# Altium schematic sheet TIDA-010967_DC_Regulators.SchDoc: DC_REGULATORS
size 431 x 279 mm; Date: Not shown in title block; ApprovedBy: Not shown in title block; CheckedBy: Not shown in title block; Author: Not shown in title block; CompanyName: Not shown in title block; DrawnBy: Justin Yin; Engineer: Not shown in title block; Organization: Not shown in title block; Address1: Not shown in title block; Address2: Not shown in title block; Address3: Not shown in title block; Address4: Not shown in title block; DocumentNumber: 4; Revision: Use project parameter SCH_Rev; SheetNumber: 4; SheetTotal: 8; PageSetup: Record=PageOptions|CenterHorizontal=True|CenterVertical=True|PrintScale=1.00|XCorrection=1.00|YCorrection=1.00|PrintKind=0|BorderSize=5000000|LeftOffset=0|BottomOffset=0|Orientation=2|PaperLength=1000|PaperWidth=1000|Scale=100|PaperSource=15|PrintQuality=600|MediaType=1|DitherType=10|PaperKind=Letter|PrintScaleMode=1; CurrentTime: Not shown in title block; CurrentDate: Not shown in title block; Time: Not shown in title block; DocumentFullPathAndName: Not shown in title block; DocumentName: Not shown in title block; ModifiedDate: Not shown in title block; ImagePath: Not shown in title block
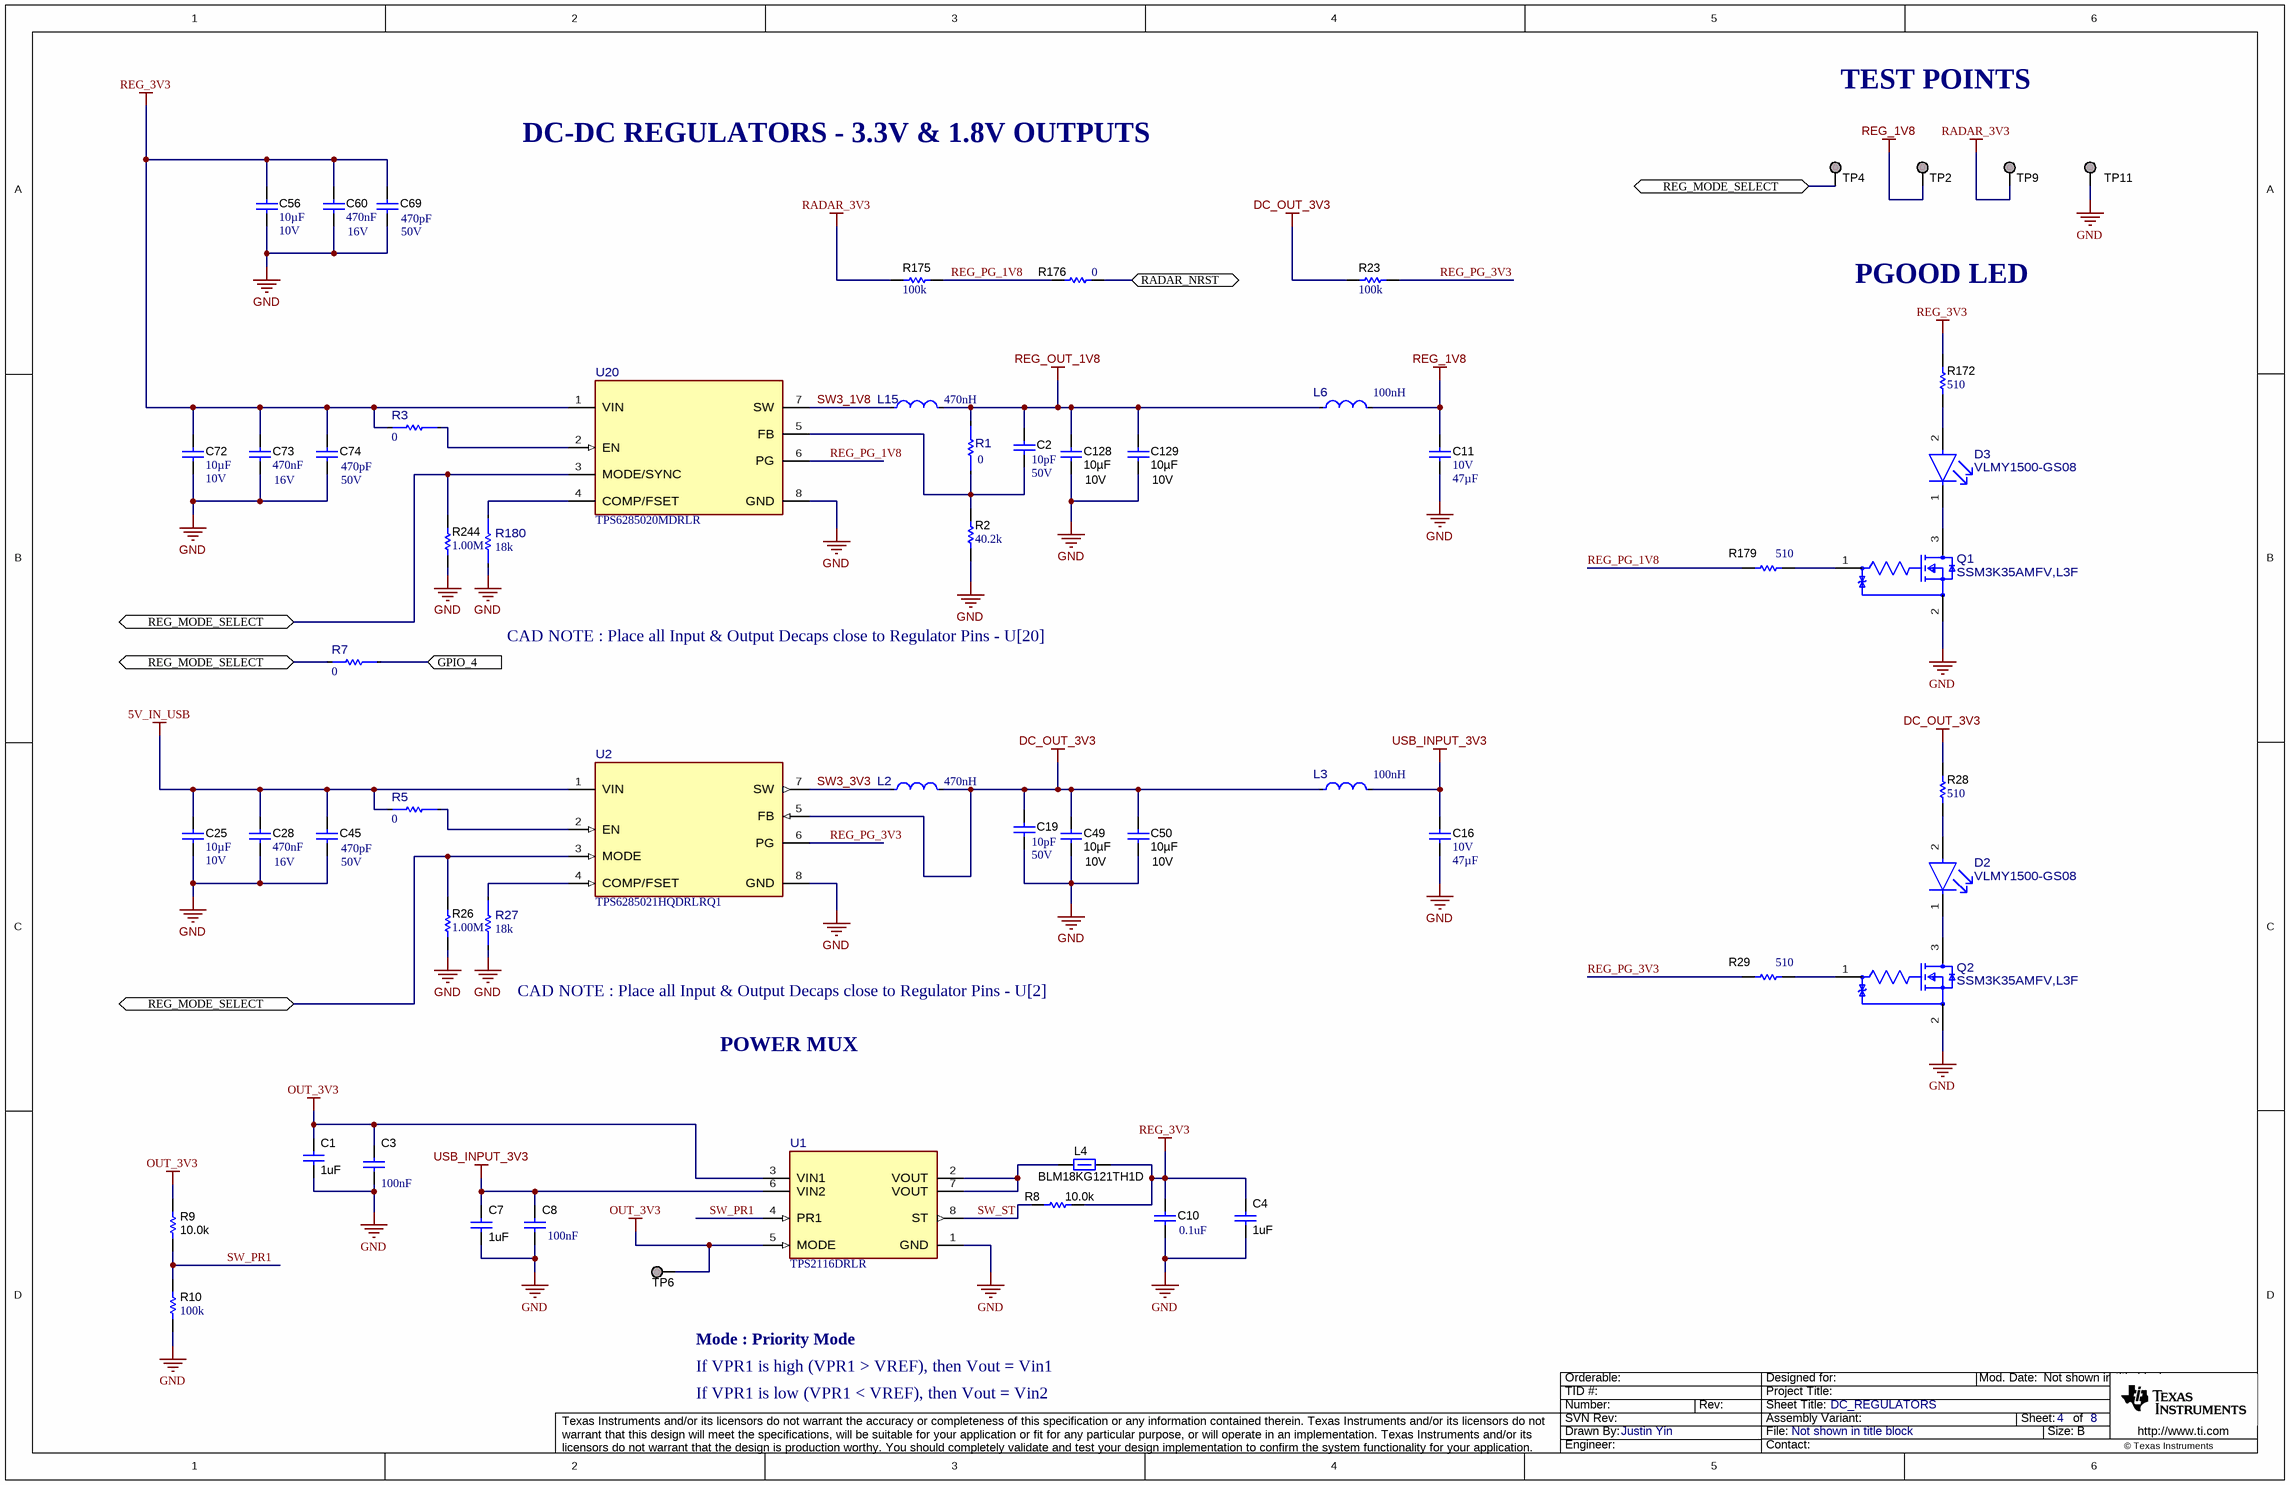
[diagram p0: TIDA-010967_DC_Regulators.SchDoc]

## Parts
C1  ValueDisplayed: 1uF  [0402L]  (hidden comment: GRT155C81A105KE01D)
C2  VDC_V: 50V  ValueDisplayed: 10pF  [0402L]  (hidden comment: GRM1555C1H100JA01D)
C3  Cap_F: 100nF  [0402]  (hidden comment: GCM155R71H104KE02D)
C4  ValueDisplayed: 1uF  [0402L]  (hidden comment: GRT155C81A105KE01D)
C7  ValueDisplayed: 1uF  [0402L]  (hidden comment: GRT155C81A105KE01D)
C8  Cap_F: 100nF  [0402]  (hidden comment: GCM155R71H104KE02D)
C10  ValueDisplayed: 0.1uF  [0402]  (hidden comment: GCM155R71H104KE02D)
C11  VDC_V: 10V  ValueDisplayed: 47µF  [0805_HV]  (hidden comment: GRM21BR61A476ME15L)
C16  VDC_V: 10V  ValueDisplayed: 47µF  [0805_HV]  (hidden comment: GRM21BR61A476ME15L)
C19  VDC_V: 50V  ValueDisplayed: 10pF  [0402L]  (hidden comment: GRM1555C1H100JA01D)
C25  Cap_F: 10µF  VDC_V: 10V  [0603_HV]  (hidden comment: GRM188Z71A106MA73D)
C28  Value2: 16V  Cap_F: 470nF  [0603L]  (hidden comment: GRM188R71C474KA88D)
C45  Value2: 50V  ValueDisplayed: 470pF  [0402L]  (hidden comment: GRM1555C1H471JA01D)
C49  Value2: 10V  Cap_F: 10µF  [0603L]  (hidden comment: GRM188Z71A106MA73D)
C50  Value2: 10V  Cap_F: 10µF  [0603L]  (hidden comment: GRM188Z71A106MA73D)
C56  Cap_F: 10µF  VDC_V: 10V  [0603_HV]  (hidden comment: GRM188Z71A106MA73D)
C60  Value2: 16V  Cap_F: 470nF  [0603L]  (hidden comment: GRM188R71C474KA88D)
C69  Value2: 50V  ValueDisplayed: 470pF  [0402L]  (hidden comment: GRM1555C1H471JA01D)
C72  Cap_F: 10µF  VDC_V: 10V  [0603_HV]  (hidden comment: GRM188Z71A106MA73D)
C73  Value2: 16V  Cap_F: 470nF  [0603L]  (hidden comment: GRM188R71C474KA88D)
C74  Value2: 50V  ValueDisplayed: 470pF  [0402L]  (hidden comment: GRM1555C1H471JA01D)
C128  Value2: 10V  Cap_F: 10µF  [0603L]  (hidden comment: GRM188Z71A106MA73D)
C129  Value2: 10V  Cap_F: 10µF  [0603L]  (hidden comment: GRM188Z71A106MA73D)
D2  VLMY1500-GS08  [FP-VLMY1500-GS08_0402-MFG]
D3  VLMY1500-GS08  [FP-VLMY1500-GS08_0402-MFG]
L2  Ind_H: 470nH  [FP-DFE201210U-R47M=P2_0805 (2012)-MFG]  (hidden comment: DFE201210U-R47M=P2)
L3  Ind_H: 100nH  [FP-SPH201610UR10MT_SMT_IND_2MM0_1MM6-MFG]  (hidden comment: SPH201610UR10MT)
L4  BLM18KG121TH1D  [0603L]
L6  Ind_H: 100nH  [FP-SPH201610UR10MT_SMT_IND_2MM0_1MM6-MFG]  (hidden comment: SPH201610UR10MT)
L15  Ind_H: 470nH  [FP-DFE201210U-R47M=P2_0805 (2012)-MFG]  (hidden comment: DFE201210U-R47M=P2)
Q1  SSM3K35AMFV,L3F  [FP-SSM3K35AMFV,L3F_SOT-723-MFG]
Q2  SSM3K35AMFV,L3F  [FP-SSM3K35AMFV,L3F_SOT-723-MFG]
R1  value 0  [FP-RC0402JR-070RP_0402-MFG]  (hidden comment: RC0402JR-070RP)
R2  ValueDisplayed: 40.2k  [0402L]  (hidden comment: CRCW040240K2FKED)
R3  value 0  [FP-RC0402JR-070RP_0402-MFG]  (hidden comment: RC0402JR-070RP)
R5  value 0  [FP-RC0402JR-070RP_0402-MFG]  (hidden comment: RC0402JR-070RP)
R7  value 0  [FP-RC0402JR-070RP_0402-MFG]  (hidden comment: RC0402JR-070RP)
R8  ValueDisplayed: 10.0k  [0402L]  (hidden comment: CRCW040210K0FKED)
R9  ValueDisplayed: 10.0k  [0402L]  (hidden comment: CRCW040210K0FKED)
R10  value 100k  [0402]  (hidden comment: CRCW0402100KFKED)
R23  value 100k  [0201L]  (hidden comment: CRCW0201100KFKED)
R26  ValueDisplayed: 1.00M  [0402]  (hidden comment: RC0402FR-071ML)
R27  value 18k  [FP-CRCW040218K0FKEDC_0402-MFG]  (hidden comment: CRCW040218K0FKEDC)
R28  ValueDisplayed: 510  [0402L]  (hidden comment: ERJ-2RKF5100X)
R29  ValueDisplayed: 510  [0402L]  (hidden comment: ERJ-2RKF5100X)
R172  ValueDisplayed: 510  [0402L]  (hidden comment: ERJ-2RKF5100X)
R175  value 100k  [0201L]  (hidden comment: CRCW0201100KFKED)
R176  Res_ohm: 0  [FP-RC0201JR-070RL_0201 (0603 Metric)-IPC_C]  (hidden comment: RC0201JR-070RL)
R179  ValueDisplayed: 510  [0402L]  (hidden comment: ERJ-2RKF5100X)
R180  value 18k  [FP-CRCW040218K0FKEDC_0402-MFG]  (hidden comment: CRCW040218K0FKEDC)
R244  ValueDisplayed: 1.00M  [0402]  (hidden comment: RC0402FR-071ML)
TP2  TESTPOINT  [TP_25MIL-SMT]  (value not drawn)  (no BOM)
TP4  TESTPOINT  [TP_25MIL-SMT]  (value not drawn)  (no BOM)
TP6  TESTPOINT  [TP_25MIL-SMT]  (value not drawn)  (no BOM)
TP9  TESTPOINT  [TP_25MIL-SMT]  (value not drawn)  (no BOM)
TP11  TESTPOINT  [TP_25MIL-SMT]  (value not drawn)  (no BOM)
U1  TPS2116DRLR  [DRL0008A-MFG]
U2  TPS6285021HQDRLRQ1  [DRL0008A-MFG]
U20  TPS6285020MDRLR  [DRL0008A-MFG]

## Ports
GPIO_4 (in), RADAR_NRST (bidir), REG_MODE_SELECT (bidir)

## Nets
5V_IN_USB: C25.1 C28.1 C45.1 R5.2 U2.1(VIN)
DC_OUT_3V3: C19.1 C49.1 C50.1 L2.2 L3.1 R23.1 R28.1 U2.5(FB)
GND: C1.2 C3.2 C4.2 C7.2 C8.1 C10.2 C11.2 C16.2 C19.2 C25.2 C28.2 C45.2 C49.2 C50.2 C56.2 C60.2 C69.2 C72.2 C73.2 C74.2 C128.2 C129.2 Q1.2(S) Q2.2(S) R2.1 R10.1 R26.2 R27.2 R180.2 R244.2 TP11.1 U1.1(GND) U2.8(GND) U20.8(GND)
OUT_3V3: C1.1 C3.1 R9.2 TP6.1 U1.3(VIN1) U1.5(MODE)
RADAR_3V3: R175.1 TP9.1
REG_1V8: C11.1 L6.2 TP2.1
REG_3V3: C4.1 C10.1 C56.1 C60.1 C69.1 C72.1 C73.1 C74.1 L4.2 R3.2 R8.1 R172.1 U20.1(VIN)
REG_OUT_1V8: C2.1 C128.1 C129.1 L6.1 L15.2 R1.2
USB_INPUT_3V3: C7.1 C8.2 C16.1 L3.2 U1.6(VIN2)
GPIO_4: R7.1 ; port GPIO_4
RADAR_NRST: R176.1 ; port RADAR_NRST
REG_MODE_SELECT: R7.2 R26.1 R244.1 TP4.1 U2.3(MODE) U20.3(MODE/SYNC) ; port REG_MODE_SELECT
REG_PG_1V8: R175.2 R176.2 R179.2 U20.6(PG)
REG_PG_3V3: R23.2 R29.2 U2.6(PG)
SW3_1V8: L15.1 U20.7(SW)
SW3_3V3: L2.1 U2.7(SW)
SW_PR1: R9.1 R10.2 U1.4(PR1)
SW_ST: R8.2 U1.8(ST)
NetC2_2: C2.2 R1.1 R2.2 U20.5(FB)
NetD2_1: D2.1(CATHODE) Q2.3(D)
NetD2_2: D2.2(ANODE) R28.2
NetD3_1: D3.1(CATHODE) Q1.3(D)
NetD3_2: D3.2(ANODE) R172.2
NetL4_1: L4.1 U1.2(VOUT) U1.7(VOUT)
NetQ1_1: Q1.1(G) R179.1
NetQ2_1: Q2.1(G) R29.1
NetR3_1: R3.1 U20.2(EN)
NetR5_1: R5.1 U2.2(EN)
NetR27_1: R27.1 U2.4(COMP/FSET)
NetR180_1: R180.1 U20.4(COMP/FSET)

## Notes on the sheet
- TEST POINTS
- DC-DC REGULATORS - 3.3V & 1.8V OUTPUTS
- PGOOD LED
- CAD NOTE : Place all Input & Output Decaps close to Regulator Pins - U[20]
- CAD NOTE : Place all Input & Output Decaps close to Regulator Pins - U[2]
- POWER MUX
- Mode : Priority Mode
- If VPR1 is high (VPR1 > VREF), then Vout = Vin1
- If VPR1 is low (VPR1 < VREF), then Vout = Vin2
- Drawn By:
- SVN Rev:
- Number:
- TID #:
- Orderable:
- Rev:
- Sheet Title:
- File:
- Project Title:
- Designed for:
- Assembly Variant:
- Mod. Date:
- Sheet:
- Size:
- of
- B
- http://www.ti.com
- Texas Instruments and/or its licensors do not warrant the accuracy or completeness of this specification or any information contained therein. Texas Instruments and/or its licensors do not warrant that this design will meet the specifications, will be suitable for your application or fit for any particular purpose, or will operate in an implementation. Texas Instruments and/or its licensors do not warrant that the design is production worthy. You should completely validate and test your design implementation to confirm the system functionality for your application.
- Engineer:
- Contact:
- © Texas Instruments

## Library data of the parts
C1 C4 C7 = CMP-0006272-2: CAP, CERM, 1 uF, 10 V, +/- 10%, X6S, 0402; Manufacturer: TDK; Polarized: N; Value: 1uF; U/M: EA; Cap_F: 1µF; Value1: Unknown; VDC_V: 16V; TempCo: X5R; TaMin_C: -55°C; TaMax_C: 85°C; Cap_Case: 0402; SizeArea_mm2: 0.5; SizeAreaWB_mm2: 3; SizeX_mm: 1; SizeZ_mm: 0.6; AEC Category: Q200; CompType: Capacitor; PartNumber: GRT155C81A105KE01D; PackageReference: 0402; RoHS: Y; Tolerance_%: 10%; Value2: 16V; MountType: SMT; Technology: Ceramic; SizeY_mm: 0.5; Published: 2008-06-19; Publisher: Texas Instruments; LatestRevisionDate: 2017-03-09; ComponentLink1Description: Datasheet link; ComponentLink1URL: https://product.tdk.com/info/en/catalog/datasheets/mlcc_commercial_general_en.pdf; Supplier 1: Digi-Key; Supplier Part Number 1: 445-4978-1-ND; Supplier 2: Newark; Supplier Part Number 2: 90R7590; Supplier 3: Mouser; Supplier Part Number 3: 810-C1005X5R1C105K; AEC Qualified: N; AEC Grade: N/A
C2 C19 = CMP-0006408-2: CAP, CERM, 10 pF, 50 V, +/- 5%, C0G/NP0, 0402; Manufacturer: MuRata; TaMin_C: -55°C; Polarized: N; SizeAreaWB_mm2: 3; Value1: Unknown; U/M: EA; Value: 10pF; TaMax_C: 125°C; SizeZ_mm: 0.6; SizeX_mm: 1; SizeY_mm: 0.5; Cap_Case: 0402; AEC Category: Q200; Publisher: Texas Instruments; TempCo: C0G/NP0; Published: 2008-06-19; RoHS: Y; MountType: SMT; Supplier 1: Mouser; PackageReference: 0402; Tolerance_%: 5%; Value2: 50V; SizeArea_mm2: 0.5; CompType: Capacitor; LatestRevisionDate: 2017-03-09; PartNumber: GRM1555C1H100JA01D; AEC Qualified: ?; Cap_F: 10pF; ComponentLink1Description: Datasheet link; Supplier Part Number 1: 81-GRM1555C1H100JA1D; Technology: Ceramic; ComponentLink1URL: http://search.murata.co.jp/Ceramy/PnsearchViewAction.do?HnOFG=ON&HnNFG=ON&SEL_CNT=50&sLang=en&sKey=GRM1555C1H100JA01D&x=9&y=9&search=startwith
C3 C8 = CMP-0006356-2: CAP, CERM, 0.1 uF, 50 V, +/- 10%, X7R, AEC-Q200 Grade 1, 0402; Manufacturer: MuRata; AEC Qualified: Y; SizeZ_mm: 0.6; VDC_V: 50V; AEC Category: Q200; AEC Grade: 1; Polarized: N; SizeArea_mm2: 0.5; SizeAreaWB_mm2: 3; TaMax_C: 125°C; TaMin_C: -55°C; U/M: EA; Value1: Unknown; Value: 0.1uF; RoHS: Y; ComponentLink1Description: Datasheet link; ComponentLink1URL: http://psearch.en.murata.com/capacitor/product/GCM155R71H104KE02%23.pdf; PackageReference: 0402; PartNumber: GCM155R71H104KE02D; TempCo: X7R; Tolerance_%: 10%; Cap_Case: 0402; CompType: Capacitor; LatestRevisionDate: 2017-03-09; MountType: SMT; Published: 2008-06-19; Publisher: Texas Instruments; SizeX_mm: 1; SizeY_mm: 0.5; Supplier 1: Digi-Key; Supplier 2: Mouser; Supplier Part Number 1: 490-10672-1-ND; Supplier Part Number 2: 81-GCM155R71H104KE2D; Technology: Ceramic; Value2: 50V; ValueDisplayed: 0.1uF
C10 = CMP-0006356-2: CAP, CERM, 0.1 uF, 50 V, +/- 10%, X7R, AEC-Q200 Grade 1, 0402; Manufacturer: MuRata; TaMin_C: -55°C; Polarized: N; SizeAreaWB_mm2: 3; Value1: Unknown; U/M: EA; Value: 0.1uF; TaMax_C: 125°C; SizeZ_mm: 0.6; SizeX_mm: 1; SizeY_mm: 0.5; Value2: 50V; AEC Qualified: Y; Cap_F: 100nF; AEC Category: Q200; Supplier Part Number 2: 81-GCM155R71H104KE2D; Publisher: Texas Instruments; Supplier 2: Mouser; TempCo: X7R; Published: 2008-06-19; RoHS: Y; MountType: SMT; Supplier 1: Digi-Key; PackageReference: 0402; Tolerance_%: 10%; Cap_Case: 0402; SizeArea_mm2: 0.5; CompType: Capacitor; LatestRevisionDate: 2017-03-09; PartNumber: GCM155R71H104KE02D; VDC_V: 50V; ComponentLink1Description: Datasheet link; AEC Grade: 1; Supplier Part Number 1: 490-10672-1-ND; Technology: Ceramic; ComponentLink1URL: http://psearch.en.murata.com/capacitor/product/GCM155R71H104KE02%23.pdf
C11 C16 = CMP-0078699-1: CAP, CERM, 47 µF, 10 V,+/- 20%, X5R, 0805; Manufacturer: MuRata; TaMin_C: -55°C; Polarized: N; Green_Lifecycle: Active; SizeAreaWB_mm2: 6.75; Green_REACh: Passed; U/M: EA; Value: 47uF; TaMax_C: 85°C; SizeZ_mm: 1.45; SizeX_mm: 2; SizeY_mm: 1.25; Cap_Case: 0805; SizeArea_mm2: 2.5; AEC Category: Q200; ComponentLink1URL: http://search.murata.co.jp/Ceramy/image/img/A01X/G101/ENG/GRM21BR61A476ME15-01.pdf; Supplier Part Number 2: 96Y9273; Supplier 2: Newark; Supplier Part Number 3: 81-GRM21BR61A476ME5L; TempCo: X5R; Supplier 3: Mouser; RoHS: Y; MountType: SMT; Green_EU RoHS-2: Incomplete; Supplier 1: Digi-Key; Green_EU RoHS: Passed; PackageReference: 0805; Tolerance_%: 20%; Value2: 10V; CompType: Capacitor; PartNumber: GRM21BR61A476ME15L; AEC Qualified: N; Cap_F: 47µF; ComponentLink1Description: Datasheet link; AEC Grade: N/A; Supplier Part Number 1: 490-9961-1-ND; Technology: Ceramic
C25 C49 C50 C56 C72 C128 C129 = CMP-0007497-5: CAP, CERM, 10 uF, 10 V, +/- 20%, X7R, 0603; Manufacturer: MuRata; TaMin_C: -55°C; Polarized: N; SizeAreaWB_mm2: 4.68; Value1: Unknown; U/M: EA; Value: 10uF; TaMax_C: 125°C; SizeZ_mm: 1; SizeX_mm: 1.6; SizeY_mm: 0.8; Cap_Case: 0603; SizeArea_mm2: 1.28; AEC Category: Q200; Publisher: Texas Instruments; TempCo: X7R; Published: 2008-06-19; RoHS: Y; MountType: SMT; Supplier 1: Mouser; PackageReference: 0603; Tolerance_%: 20%; CompType: Capacitor; LatestRevisionDate: 2017-03-09; PartNumber: GRM188Z71A106MA73D; AEC Qualified: N; ComponentLink1Description: Datasheet link; AEC Grade: N/A; Supplier Part Number 1: 81-GRM188Z71A106MA3D; Technology: Ceramic; ValueDisplayed: 10uF; ComponentLink1URL: http://psearch.en.murata.com/capacitor/product/GRM188Z71A106MA73%23.pdf
  C25 C56 C72: Value2: 10V
  C49 C50 C128 C129: VDC_V: 10V
C28 C60 C73 = CMP-0007398-4: CAP, CERM, 0.47 uF, 16 V, +/- 10%, X7R, 0603; Manufacturer: MuRata; TaMin_C: -55°C; Polarized: N; SizeAreaWB_mm2: 4.68; Value1: Unknown; U/M: EA; Value: 0.47uF; TaMax_C: 125°C; SizeZ_mm: 1; SizeX_mm: 1.6; SizeY_mm: 0.8; Cap_Case: 0603; SizeArea_mm2: 1.28; AEC Category: Q200; Supplier Part Number 2: 81-GRM188R71C474KA88; Publisher: Texas Instruments; Supplier 2: Mouser; Supplier Part Number 3: 1828893; TempCo: X7R; Supplier 3: Farnell; Published: 2008-06-19; RoHS: Y; MountType: SMT; Supplier 1: Digi-Key; PackageReference: 0603; Tolerance_%: 10%; CompType: Capacitor; LatestRevisionDate: 2017-03-09; PartNumber: GRM188R71C474KA88D; AEC Qualified: ?; VDC_V: 16V; ComponentLink1Description: Datasheet link; Supplier Part Number 1: 490-3295-1-ND; Technology: Ceramic; ValueDisplayed: 0.47uF; ComponentLink1URL: http://search.murata.co.jp/Ceramy/PnsearchViewAction.do?HnOFG=ON&HnNFG=ON&SEL_CNT=50&sLang=en&sKey=GRM188R71C474KA88D&x=9&y=9&search=startwith
C45 C69 C74 = CMP-0006470-2: CAP, CERM, 470 pF, 50 V, +/- 5%, C0G/NP0, 0402; Manufacturer: MuRata; TaMin_C: -55°C; Polarized: N; SizeAreaWB_mm2: 3; Value1: Unknown; U/M: EA; Value: 470pF; TaMax_C: 125°C; SizeZ_mm: 0.6; SizeX_mm: 1; SizeY_mm: 0.5; Cap_Case: 0402; AEC Category: Q200; Supplier Part Number 2: 81-GRM1555C1H471JA01; Publisher: Texas Instruments; Supplier 2: Mouser; Supplier Part Number 3: 8819688; TempCo: C0G/NP0; Supplier 3: Farnell; Published: 2008-06-19; RoHS: Y; MountType: SMT; Supplier 1: Digi-Key; PackageReference: 0402; Tolerance_%: 5%; SizeArea_mm2: 0.5; CompType: Capacitor; LatestRevisionDate: 2017-03-09; PartNumber: GRM1555C1H471JA01D; AEC Qualified: ?; Cap_F: 470pF; VDC_V: 50V; ComponentLink1Description: Datasheet link; Supplier Part Number 1: 490-1297-1-ND; Technology: Ceramic; ComponentLink1URL: http://search.murata.co.jp/Ceramy/PnsearchViewAction.do?HnOFG=ON&HnNFG=ON&SEL_CNT=50&sLang=en&sKey=GRM1555C1H471JA01D&x=9&y=9&search=startwith
D2 D3 = CMP-0090807-1: LED Uni-Color Yellow 588nm 2-Pin Chip 0402(1006Metric) T/R; Manufacturer: Vishay; AEC Qualified: No; Led Orientation: Top View; SizeZ_mm: 0.35mm; TaMin_C: -30°C; Angle: 130°; LambdaD: 590nm; Power_TotalModule: 75mW; TaMax_C: +85°C; Forward Current: 20mA; Vr_V: 5V; Vf_V: 2V; Luminous Intensity: 90mcd; Lead Free: Yes; LambdaP: 588nm; helpURL: https://upverter.com/upn/revision/6fc1d97824805f25/; ComponentLink1URL: https://www.vishay.com/docs/82554/vlmo1500.pdf; Mouser Part Number: 78-VLMY1500-GS08; PackageReference: 0402; Digikey Part Number: VLMY1500-GS08CT-ND; Digikey Description: LED YELLOW 0402 SMD; Datasheet Path: datasheets/Diode-VLMY1500-GS08.pdf; ComponentLink1Description: Datasheet; Color: Yellow; Mounting Type: Surface Mount; datasheet: https://www.vishay.com/docs/82554/vlmo1500.pdf; PartNumber: VLMY1500-GS08; Mouser Description: VLMY1500-GS08 Yellow LED, 597 nm 1005 (0402), Square Lens SMD package; RoHS: TRUE; Operating Temperature Range: -30°C to +85 °C; Part Number: VLMY1500-GS08
L2 L15 = CMP-0092096-1: 470nH Shielded Wirewound Inductor 3A 42mOhm Max 0805 (2012 Metric); Manufacturer: Murata; DCR_ohm: 42m; Shrouded: true; SizeZ_mm: 1mm; Value: 0.47uH; Tolerance_%: 20%; Test Frequency: 1MHz; Isat: 4.4A; AEC Qualified: No; Material: Metal Alloy; RoHS: TRUE; Supplier 1: Digikey; datasheet: https://www.murata.com/en-us/products/productdetail?partno=DFE201210U-R47M%23; Mouser Part Number: 81-DFE201210U-R47MP2; helpURL: https://upverter.com/upn/revision/7b65c208f048e6ea/; Datasheet Path: datasheets/Ind-DFE201210U-R47M=P2.pdf; Operating Temperature Range: -40°C to +125°C; Digikey Part Number: 490-17727-1-ND; PackageReference: 0805 (2012); Supplier Part Number 2: 81-DFE201210U-R47MP2; PartNumber: DFE201210U-R47M=P2; Part Number: DFE201210U-R47M=P2; Irms: 3A; ComponentLink1URL: https://www.murata.com/en-us/products/productdetail?partno=DFE201210U-R47M%23; Supplier Part Number 1: 490-17727-1-ND; Technology: Wirewound; ComponentLink1Description: Datasheet; Lead Free: Yes; Digikey Description: FIXED IND .47UH 3.0A 42MOHM; Supplier 2: Mouser
L3 L6 = CMP-0124620-1: 100 nH Shielded Drum Core, Wirewound Inductor 3.65 A 22mOhm Max 0806 (2016 Metric); Manufacturer: Sunlord; AEC Qualified: No; DCR_ohm: 22m; Irms: 4.25A; Isat: 4.8A; Material: Ferrite; SizeZ_mm: 1mm; Value: 0.1uH; Self Resonant Frequency: 583MHz; Shrouded: true; Test Frequency: 1MHz; Tolerance_%: 20%; PackageReference: SMT_IND_2MM0_1MM6; PartNumber: SPH201610UR10MT; RoHS: TRUE; Supplier 1: Digikey; Supplier Part Number 1: 3442-SPH201610UR10MTTR-ND; Technology: Wirewound; Part Number: SPH201610UR10MT; datasheet: https://www.sunlordinc.com/uploads/files/20240806/en/SPH%C2%A0Series%C2%A0of%C2%A0SMD%C2%A0Power%C2%A0Inductor.pdf; Datasheet Date: 2024-06-19; Datasheet Path: datasheets/Ind-SPH201610UR10MT.pdf; Digikey Description: FIXED IND 100NH 3.65A 22MOHM SMD; Digikey Part Number: 3442-SPH201610UR10MTTR-ND; helpURL: https://upverter.com/upn/revision/4015f0fc3580b88b/; Lead Free: Yes; Operating Temperature Range: -40°C to +125°C; ComponentLink1Description: Datasheet; ComponentLink1URL: https://www.sunlordinc.com/uploads/files/20240806/en/SPH%C2%A0Series%C2%A0of%C2%A0SMD%C2%A0Power%C2%A0Inductor.pdf
L4 = CMP-0077879-2: Ferrite Bead, 120 ohm @ 100 MHz, 1.9 A, 0603; Manufacturer: MuRata; ZTyp@100MHz_Ohm: 120; SizeAreaWB_mm2: 4.68; DCR_ohm: 0.04; Value1: 0.04 ohm; Value: 120 ohm; Imax_A: 1.9A; SizeZ_mm: 1.0; SizeX_mm: 1.6; SizeY_mm: 0.8; SizeArea_mm2: 1.28; ComponentLink1URL: http://www.murata.com/en-global/products/productdata/8796737273886/QNFA9101.pdf; Supplier Part Number 2: 81-BLM18KG121TH1D; Supplier 2: Mouser; RoHS: Y; MountType: SMT; Supplier 1: Digi-Key; PackageReference: 0603; Value2: 1.9A; CompType: Ferrite Bead; PartNumber: BLM18KG121TH1D; ComponentLink1Description: Datasheet link; Supplier Part Number 1: 490-13261-1-ND; ValueDisplayed: 120 ohm
Q1 Q2 = CMP-0091833-1: N-Channel 20V 250mA (Ta) 500mW (Ta) Surface Mount VESM; Manufacturer: Toshiba; Threshold Vgs Min: 0.35V; QgTyp_nC: 0.34nC @ 4.5V; AEC Qualified: No; Rdson45_ohm: 0.75; TJmax_C: +150°C; Input Capacitace At Vds: 18pF @ 10V; SizeZ_mm: 0.55mm; Pulse Drain Current: 600mA; Threshold Vgs Max: 1V; Vgs_V: 10V; Typ Forward Diode Voltage: 0.8V; VdsMax_V: 1.2V; Power_W: 150mW; Number Of N Channels: 1; Turn Off Delay Time: 6.5ns; ChMode: False; Turn On Delay Time: 2ns; PackageReference: SOT-723; ComponentLink1URL: https://toshiba.semicon-storage.com/info/docget.jsp?did=55390&prodName=SSM3K35AMFV; Part Number: SSM3K35AMFV,L3F; IdsMax_A: 250mA; Mouser Part Number: 757-SSM3K35AMFVL3F; PartNumber: SSM3K35AMFV,L3F; helpURL: https://upverter.com/upn/revision/e3a5b9c3bcd77515/; Drain To Source Breakdown Voltage: 20V; RoHS: TRUE; ComponentLink1Description: Datasheet; Digikey Description: MOSFET N-CH 20V 250MA VESM; Digikey Part Number: SSM3K35AMFVL3FCT-ND; Lead Free: Yes; Operating Temperature Range: to +150°C; Datasheet Path: datasheets/Trans-SSM3K35AMFV,L3F.pdf; datasheet: https://toshiba.semicon-storage.com/info/docget.jsp?did=55390&prodName=SSM3K35AMFV; Number Of Channels: 1
R1 R3 R5 R7 = CMP-0093147-1: Res Jumper Thick Film 0402 0 Ohm 5% 1/16W Molded SMD Paper T/R; Manufacturer: Yageo; AEC Qualified: No; Power_W: 63mW; SizeZ_mm: 0.4mm; VDC_V: 50V; ComponentLink1URL: https://www.yageo.com/upload/media/product/productsearch/datasheet/rchip/PYu-RC_51_RoHS_P_2.pdf; RoHS: TRUE; Mouser Part Number: 603-RC0402JR-070RP; helpURL: https://upverter.com/upn/revision/1e1ee5977c47aafb/; Supplier Part Number 2: 603-RC0402JR-070RP; Res_ohm: 0; Supplier Part Number 1: YAG1279CT-ND; Technology: Thick Film; Datasheet Path: datasheets/Res-RC0402JR-070RP.pdf; Lead Free: Yes; Part Number: RC0402JR-070RP; ComponentLink1Description: Datasheet; Supplier 1: Digikey; PartNumber: RC0402JR-070RP; Mouser Description: RC Series 0402 Jumper Thick Film Chip Resistor; Operating Temperature Range: -55°C to +155°C; datasheet: https://www.yageo.com/upload/media/product/productsearch/datasheet/rchip/PYu-RC_51_RoHS_P_2.pdf; PackageReference: 0402; Digikey Part Number: YAG1279CT-ND; Digikey Description: RES SMD 0 OHM JUMPER 1/16W 0402; Series: RC_P; Supplier 2: Mouser
R2 = CMP-0026367-2: RES, 40.2 k, 1%, 0.063 W, AEC-Q200 Grade 0, 0402; Manufacturer: Vishay-Dale; Power_W: 63mW; TempCo: 100 ppm/C; Value_Code: 40k2; Value: 40.2k; EIA_Code: E96; SizeX_mm: 1; SizeY_mm: 0.5; SizeZ_mm: 0.6; Value2: 0.063W; AEC Qualified: Y; VDC_V: 50V; AEC Category: Q200; AEC Grade: 0; ComponentLink1URL: http://www.vishay.com/docs/20035/dcrcwe3.pdf; Supplier Part Number 2: 52K7049; Supplier 2: Newark; Supplier Part Number 3: 71-CRCW0402-40.2K-E3; Supplier 3: Mouser; RoHS: E; Value1: 1%; MountType: SMT; Supplier 1: Digi-Key; PackageReference: 0402; Tolerance_%: 1%; Res_ohm: 40.2k; SizeArea_mm2: 0.5; CompType: Resistor; PartNumber: CRCW040240K2FKED; ComponentLink1Description: Datasheet link; Supplier Part Number 1: 541-40.2KLCT-ND; Technology: Thick Film
R8 R9 = CMP-0025958-3: RES, 10.0 k, 1%, 0.063 W, AEC-Q200 Grade 0, 0402; Manufacturer: Vishay-Dale; Power_W: 63mW; TempCo: 100 ppm/C; Value_Code: 10k0; Value: 10.0k; EIA_Code: E96; Res_ohm: 10k; SizeX_mm: 1; SizeY_mm: 0.5; SizeZ_mm: 0.6; Value2: 0.063W; AEC Qualified: Y; VDC_V: 50V; AEC Category: Q200; AEC Grade: 0; Supplier Part Number 2: 52K6595; Supplier 2: Newark; Supplier Part Number 3: 71-CRCW0402-10K-E3; Supplier 3: Mouser; RoHS: E; Value1: 1%; MountType: SMT; Supplier 1: Digi-Key; PackageReference: 0402; Tolerance_%: 1%; SizeArea_mm2: 0.5; CompType: Resistor; PartNumber: CRCW040210K0FKED; ComponentLink1Description: Datasheet link; Supplier Part Number 1: 541-10.0KLCT-ND; Technology: Thick Film; ComponentLink1URL: http://www.vishay.com/docs/20035/dcrcwe3.pdf
R10 = CMP-0025950-3: RES, 100 k, 1%, 0.063 W, AEC-Q200 Grade 0, 0402; Manufacturer: Vishay-Dale; AEC Category: Q200; AEC Grade: 0; AEC Qualified: Y; EIA_Code: E96; Power_W: 63mW; SizeArea_mm2: 0.5; SizeX_mm: 1; SizeZ_mm: 0.6; TempCo: 100 ppm/C; Value2: 0.063W; VDC_V: 50V; RoHS: E; ComponentLink1Description: Datasheet link; ComponentLink1URL: http://www.vishay.com/docs/20035/dcrcwe3.pdf; CompType: Resistor; MountType: SMT; PackageReference: 0402; PartNumber: CRCW0402100KFKED; Res_ohm: 100k; SizeY_mm: 0.5; Supplier 1: Digi-Key; Supplier 2: Newark; Supplier 3: Mouser; Supplier Part Number 1: 541-100KLCT-ND; Supplier Part Number 2: 52K6607; Supplier Part Number 3: 71-CRCW0402-100K-E3; Technology: Thick Film; Tolerance_%: 1%; Value1: 1%; Value_Code: 100k; ValueDisplayed: 100k
R23 R175 = CMP-0027261-3: RES, 100 k, 1%, 0.05 W, 0201; Manufacturer: Vishay-Dale; AEC Category: Q200; AEC Qualified: N; EIA_Code: E96; Power_W: 50mW; SizeArea_mm2: 0.18; SizeX_mm: 0.6; SizeY_mm: 0.3; SizeZ_mm: 0.26; TempCo: 100 ppm/C; Value2: 0.05W; VDC_V: 30V; RoHS: E; AEC Grade: N/A; ComponentLink1Description: Datasheet link; ComponentLink1URL: http://www.vishay.com/docs/20052/crcw0201e3.pdf; CompType: Resistor; MountType: SMT; PackageReference: 0201; PartNumber: CRCW0201100KFKED; Res_ohm: 100k; Supplier 1: Digi-Key; Supplier 2: Newark; Supplier 3: Mouser; Supplier Part Number 1: 541-100KAABCT-ND; Supplier Part Number 2: 84R1457; Supplier Part Number 3: 71-CRCW0201100KFKED; Technology: Thick Film; Tolerance_%: 1%; Value1: 1%; Value_Code: 100k; ValueDisplayed: 100k
R26 R244 = CMP-0026727-1: RES, 1.00 M, 1%, 0.063 W, 0402; Manufacturer: Yageo America; Power_W: 63mW; TempCo: 100 ppm/C; Value_Code: 1M00; U/M: EA; Value: 1.00Meg; EIA_Code: E96; Res_ohm: 1M; SizeX_mm: 1; SizeY_mm: 0.5; SizeZ_mm: 0.6; Value2: 0.063W; AEC Category: Q200; ComponentLink1URL: http://www.yageo.com/NewPortal/yageodocoutput?fileName=/pdf/R-Chip/PYu-RC_Group_51_RoHS_L_0.pdf; Supplier Part Number 2: 66R1086; Publisher: Texas Instruments; Supplier 2: Newark; Supplier Part Number 3: 603-RC0402FR-071ML; Supplier 3: Mouser; Published: 2008-06-26; RoHS: Y; Value1: 1%; MountType: SMT; Supplier 1: Digi-Key; PackageReference: 0402; Tolerance_%: 1%; SizeArea_mm2: 0.5; CompType: Resistor; LatestRevisionDate: 2017-03-09; PartNumber: RC0402FR-071ML; AEC Qualified: ?; ComponentLink1Description: Datasheet link; Supplier Part Number 1: 311-1.00MLRCT-ND; Technology: Thick Film
R27 R180 = CMP-0094741-1: Res Thick Film 0402 18K Ohm 1% 1/16W ±100ppm/°C Molded SMD Paper T/R; Manufacturer: Vishay; VDC_V: 50V; SizeZ_mm: 0.35mm; AEC Qualified: No; Power_W: 63mW; Lead Free: Yes; PackageReference: 0402; RoHS: TRUE; Tolerance_%: 1%; ComponentLink1URL: https://www.vishay.com/docs/28773/crcwce3.pdf; Datasheet Path: datasheets/Res-CRCW040218K0FKEDC.pdf; ComponentLink1Description: Datasheet; Mouser Description: Res Thick Film 0402 18K Ohm 1% 1/16W ±100ppm/°C Molded SMD Paper T/R; TempCo: 100ppm/°C; Supplier Part Number 2: 71-CRCW040218K0FKEDC; Supplier 1: Digikey; helpURL: https://upverter.com/upn/revision/f5433614e467177c/; Part Number: CRCW040218K0FKEDC; Technology: Thick Film; PartNumber: CRCW040218K0FKEDC; Supplier Part Number 1: 541-4757-1-ND; Series: CRCW-C e3; Supplier 2: Mouser; Mouser Part Number: 71-CRCW040218K0FKEDC; Operating Temperature Range: -55°C to +155°C; Res_ohm: 18k; Digikey Part Number: 541-4757-1-ND; datasheet: https://www.vishay.com/docs/28773/crcwce3.pdf; Digikey Description: RES 18K OHM 1% 1/16W 0402
R28 R29 R172 R179 = CMP-0026704-1: RES, 510, 1%, 0.1 W, 0402; Manufacturer: Panasonic; Power_W: 100mW; TempCo: 100 ppm/C; Value_Code: 510R; U/M: EA; Value: 510; SizeX_mm: 1; SizeY_mm: 0.5; SizeZ_mm: 0.6; Value2: 0.1W; VDC_V: 50V; AEC Category: Q200; ComponentLink1URL: http://industrial.panasonic.com/www-data/pdf/AOA0000/AOA0000CE2.pdf; Supplier Part Number 2: 53W4394; Publisher: Texas Instruments; Supplier 2: Newark; Supplier Part Number 3: 667-ERJ-2RKF5100X; Supplier 3: Mouser; Published: 2008-06-26; RoHS: Y; Value1: 1%; MountType: SMT; Supplier 1: Digi-Key; PackageReference: 0402; Tolerance_%: 1%; Res_ohm: 510; SizeArea_mm2: 0.5; CompType: Resistor; LatestRevisionDate: 2017-03-09; PartNumber: ERJ-2RKF5100X; AEC Qualified: ?; ComponentLink1Description: Datasheet link; Supplier Part Number 1: P510LCT-ND; Technology: Thick Film
R176 = CMP-0086442-2: RES SMD 0 OHM JUMPER 1/20W 0201; Manufacturer: Yageo; AEC Qualified: No; Power_W: 50mW; SizeZ_mm: 0.26mm; TempCo: 200ppm/°C; Tolerance_%: 5%; VDC_V: 25V; RoHS: TRUE; ComponentLink1Description: Datasheet; ComponentLink1URL: http://www.yageo.com/documents/recent/PYu-RC_Group_51_RoHS_L_10.pdf; PackageReference: 0201 (0603 Metric); PartNumber: RC0201JR-070RL; Technology: Thick Film
TP2 TP4 TP6 TP9 TP11 = CMP-0078143-4: TEST POINT.  No entry in BOM.; CompType: Testpoint; Manufacturer: N/A; PackageReference: N/A; PartNumber: N/A; Library Reference: TESTPOINT
U1 = CMP-0088593-2: 1.6 V to 5 V, 2.5-A Low IQ Power Mux With Manual and Automatic Switchover; Manufacturer: Texas Instruments; Max Supply Voltage: 5.5V; TaMax_C: +125°C; Output Voltage: 0-5.5V; CompType: IC; Min Supply Voltage: 1.6V; TaMin_C: -55°C; SizeZ_mm: 0.6mm; AEC Category: Q200; Nominal Supply Current: 0.5-1uA; Number Of Outputs: 1; Standoff Height: 0mm; AEC Qualified: No; ComponentLink3Description: Online Datasheet; PackageReference: FCSOT8; ComponentLink1URL: http://www.ti.com/lit/ds/symlink/GPN.pdf; Part Number: TPS2116DRLR; ComponentLink2URL: http://www.ti.com/product/GPN; Datasheet Path: datasheets/IC-TPS2116DRLR.pdf; ComponentLink3URL: http://www.ti.com/product/GPN/datasheet; RoHS: UNKNOWN; ComponentLink1Description: Datasheet Link; ComponentLink2Description: Product Folder; Lead Free: Unknown; PartNumber: TPS2116DRLR; helpURL: https://upverter.com/upn/revision/79e2fa60ca8e3747/; Operating Temperature Range: to
U2 = CMP-0092337-2: 2.7-V to 6-V, 2-A Automotive Step-Down Converter in SOT583 Package; Manufacturer: Texas Instruments; AEC Qualified: Yes; Nominal Supply Current: 17uA; Output Type: AdjustableProgrammable; AEC Category: Q200; Number Of Outputs: 1; Switching Frequency: 1.8-4MHz; TaMax_C: +125°C; Max Supply Voltage: 6V; Min Supply Voltage: 2.7V; SizeZ_mm: 0.6mm; Standoff Height: 0mm; AEC Grade: Grade 1; TJmax_C: +150°C; Switching Topology: Buck; Max Duty Cycle: 100%; TaMin_C: -40°C; CompType: IC; Output Voltage: 0.6-5.5V; ComponentLink3URL: http://www.ti.com/product/GPN/datasheet; PartNumber: TPS6285021HQDRLRQ1; helpURL: https://upverter.com/upn/revision/d90298be1e254427/; ComponentLink2Description: Product Folder; PackageReference: SOT583; Part Number: TPS6285021HQDRLRQ1; Datasheet Path: datasheets/IC-TPS6285021HQDRLRQ1.pdf; RoHS: UNKNOWN; ComponentLink3Description: Online Datasheet; ComponentLink1URL: http://www.ti.com/lit/ds/symlink/GPN.pdf; ComponentLink1Description: Datasheet Link; Operating Temperature Range: -40°C to +150°C; ComponentLink2URL: http://www.ti.com/product/GPN
U20 = CMP-0120069-1: 2.7-V to 6-V, 2-A Step-Down Converter in SOT583 Package; Manufacturer: Texas Instruments; SizeZ_mm: 0.6mm; AEC Qualified: No; Max Duty Cycle: 100%; Max Supply Voltage: 6V; Min Supply Voltage: 2.7V; Nominal Supply Current: 17uA; Number Of Outputs: 1; Output Type: AdjustableProgrammable; Output Voltage: 0.6-5.5V; Standoff Height: 0mm; Switching Frequency: 1.8-4MHz; Switching Topology: Buck; TJmax_C: +150°C; PackageReference: SOT583; PartNumber: TPS6285020MDRLR; RoHS: UNKNOWN; Operating Temperature Range: -40°C to +150°C; Part Number: TPS6285020MDRLR; Datasheet Path: datasheets/IC-TPS6285020MDRLR.pdf; helpURL: https://upverter.com/upn/revision/61877cd23c411ac8/